# Altium schematic sheet ButtonInputBoard.SchDoc
size A4; PageSetup: Record=PageOptions|CenterHorizontal=True|CenterVertical=True|PrintScale=1.00|XCorrection=1.00|YCorrection=1.00|PrintKind=1|BorderSize=5000000|LeftOffset=0|BottomOffset=0|Orientation=2|PaperLength=1000|PaperWidth=1000|Scale=100|PaperSource=7|PrintQuality=-3|MediaType=1|DitherType=10|PrintScaleMode=1|PaperKind=A1|PaperIndex=121
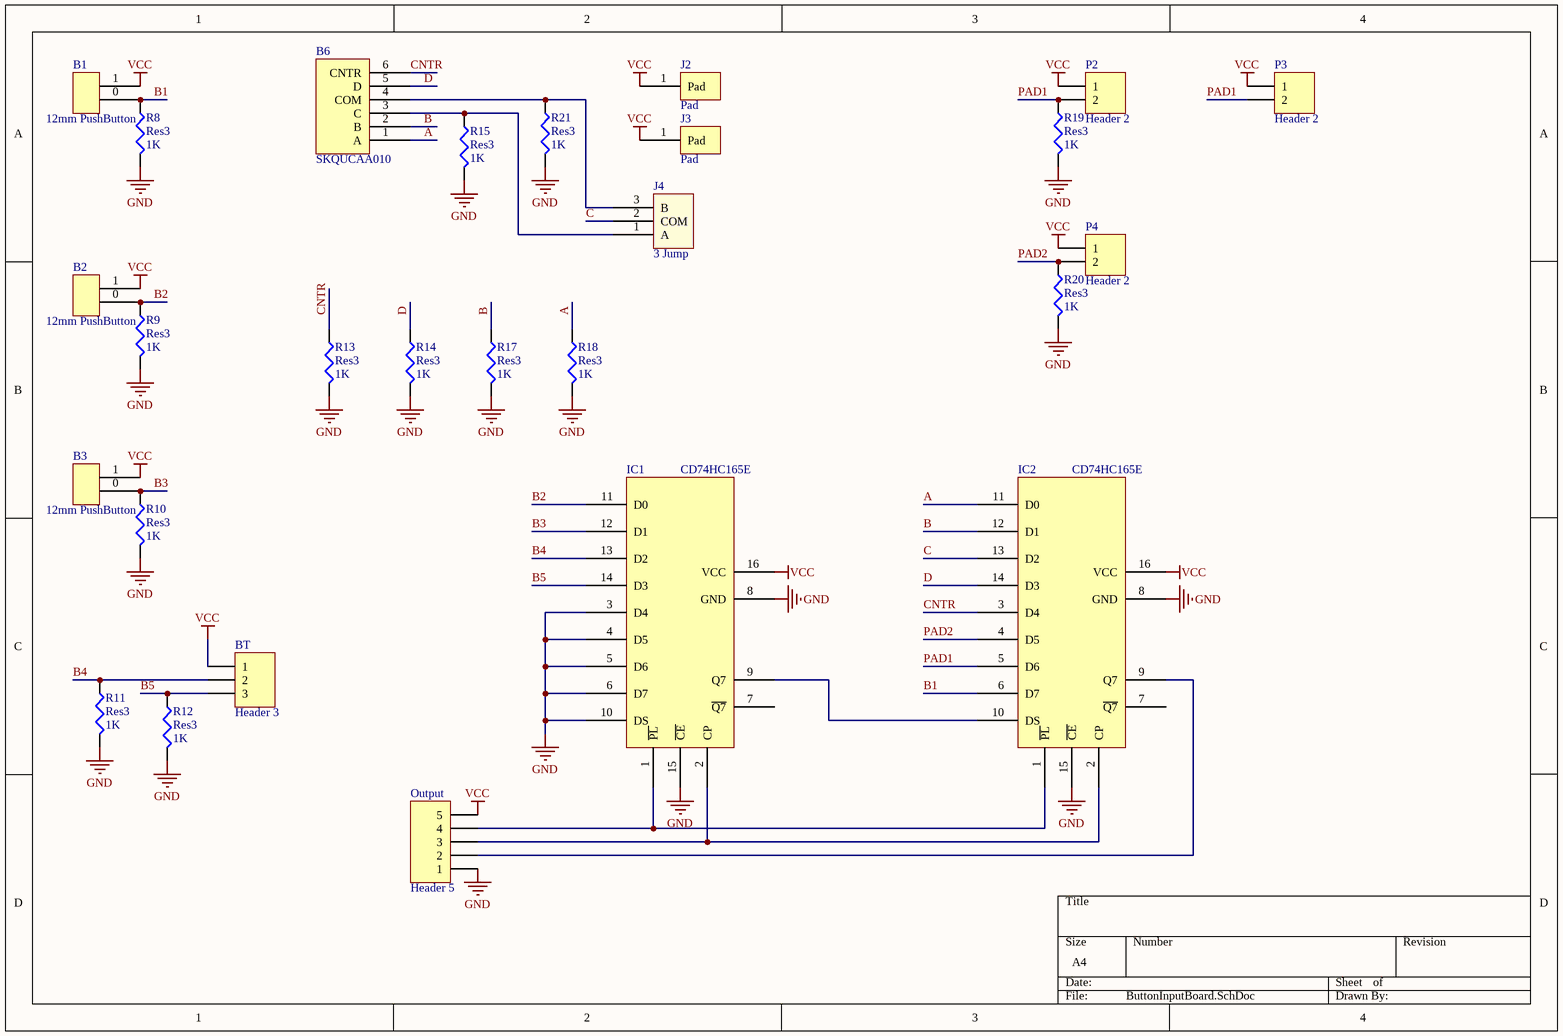
[diagram p0: ButtonInputBoard.SchDoc]

## Parts
B1  12mm PushButton  [12mm PushButton]
B2  12mm PushButton  [12mm PushButton]
B3  12mm PushButton  [12mm PushButton]
B6  SKQUCAA010  [SKQUCAA010]
BT  Header 3  [HDR1X3]
IC1  CD74HC165E  [SD74HC165E]
IC2  CD74HC165E  [SD74HC165E]
J2  Pad  [Pad]
J3  Pad  [Pad]
J4  3 Jump  [3 Jump]
Output  Header 5  [HDR1X5]
P2  Header 2  [HDR1X2]
P3  Header 2  [HDR1X2]
P4  Header 2  [HDR1X2]
R8  Res3  value 1K  [J1-0603]
R9  Res3  value 1K  [J1-0603]
R10  Res3  value 1K  [J1-0603]
R11  Res3  value 1K  [J1-0603]
R12  Res3  value 1K  [J1-0603]
R13  Res3  value 1K  [J1-0603]
R14  Res3  value 1K  [J1-0603]
R15  Res3  value 1K  [J1-0603]
R17  Res3  value 1K  [J1-0603]
R18  Res3  value 1K  [J1-0603]
R19  Res3  value 1K  [J1-0603]
R20  Res3  value 1K  [J1-0603]
R21  Res3  value 1K  [J1-0603]

## Nets
GND: IC1.3(D4) IC1.4(D5) IC1.5(D6) IC1.6(D7) IC1.8(GND) IC1.10(DS) IC1.15(~{CE}) IC2.8(GND) IC2.15(~{CE}) Output.1 R8.2 R9.2 R10.2 R11.2 R12.2 R13.2 R14.2 R15.2 R17.2 R18.2 R19.2 R20.2 R21.2
VCC: B1.1 B2.1 B3.1 BT.1 IC1.16(VCC) IC2.16(VCC) J2.1(Pad) J3.1(Pad) Output.5 P2.1 P3.1 P4.1
A: B6.1(A) IC2.11(D0) R18.1
B: B6.2(B) IC2.12(D1) R17.1
B1: B1.0 IC2.6(D7) R8.1
B2: B2.0 IC1.11(D0) R9.1
B3: B3.0 IC1.12(D1) R10.1
B4: BT.2 IC1.13(D2) R11.1
B5: BT.3 IC1.14(D3) R12.1
C: IC2.13(D2) J4.2(COM)
CNTR: B6.6(CNTR) IC2.3(D4) R13.1
D: B6.5(D) IC2.14(D3) R14.1
PAD1: IC2.5(D6) P2.2 P3.2 R19.1
PAD2: IC2.4(D5) P4.2 R20.1
NetB6_3: B6.3(C) J4.1(A) R15.1
NetB6_4: B6.4(COM) J4.3(B) R21.1
NetIC1_1: IC1.1(~{PL}) IC2.1(~{PL}) Output.4
NetIC1_2: IC1.2(CP) IC2.2(CP) Output.3
NetIC1_9: IC1.9(Q7) IC2.10(DS)
NetIC2_9: IC2.9(Q7) Output.2

Not connected (* = marked no-connect by the designer): IC1 7(~{Q7}); IC2 7(~{Q7})

## Library data of the parts
BT = Header 3: Header, 3-Pin; LatestRevisionDate: 17-Jul-2002; LatestRevisionNote: Re-released for DXP Platform.; Publisher: Altium Limited
IC1 IC2 = CD74HC165E: 8-Bit Shift Register
Output = Header 5: Header, 5-Pin; LatestRevisionDate: 17-Jul-2002; LatestRevisionNote: Re-released for DXP Platform.; Publisher: Altium Limited
P2-P4 = Header 2: Header, 2-Pin; LatestRevisionDate: 17-Jul-2002; LatestRevisionNote: Re-released for DXP Platform.; Publisher: Altium Limited
R8-R15 R17-R21 = Res3: Resistor; Published: 8-Jun-2000; LatestRevisionDate: 29-May-2009; LatestRevisionNote: IPC-7351 Footprint Added.; PackageReference: J1-0603; Publisher: Altium Limited; PackageDescription: Chip Resistor